# Altium schematic sheet con-right.SchDoc: Connector - Right
size Letter; CheckedBy: E. Chiu; CompanyName: Signal Laboratories, Inc.; DrawnBy: J. Brinton; Engineer: J. Brinton; Address1: 3479 Edison Way; Address2: Menlo Park CA 94025; Address3: +1 (877) 778-8435; Address4: siglabs.com; Revision: 1; SheetNumber: 24; SheetTotal: 40
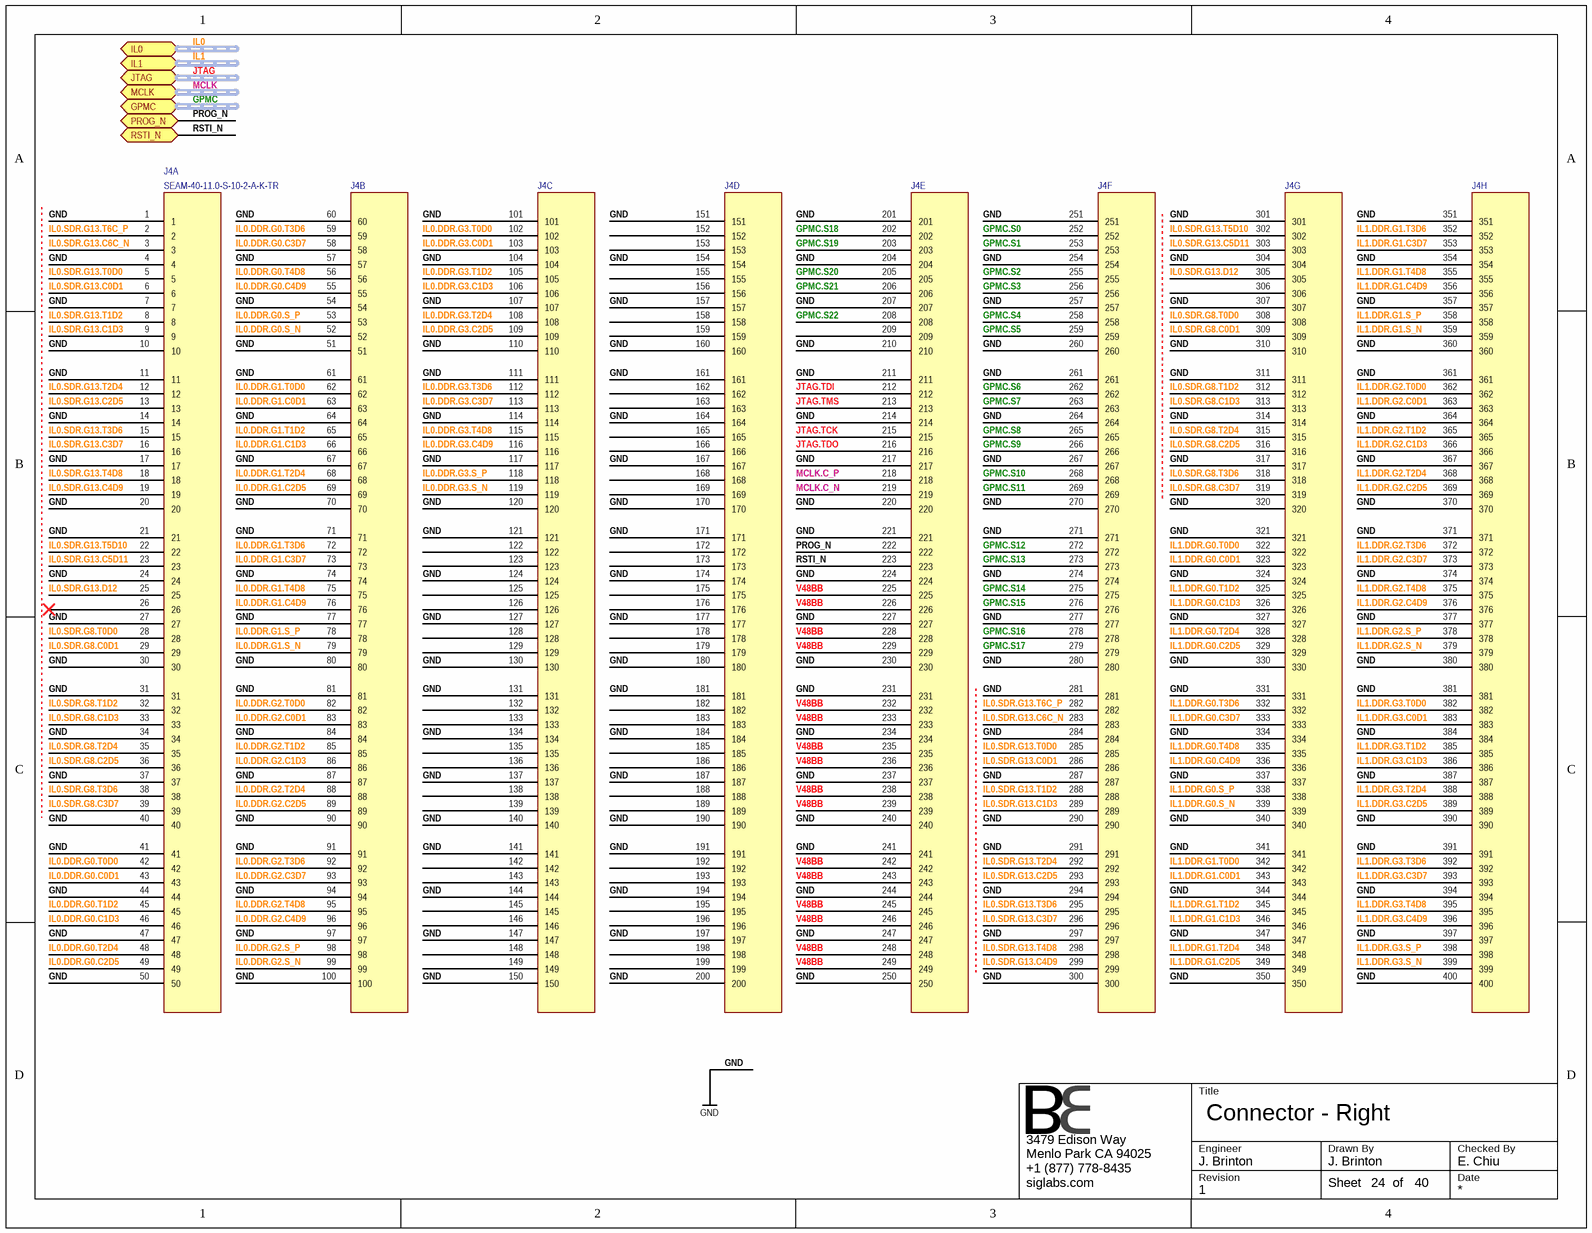
[diagram p0: con-right.SchDoc]

## Parts
J4  SEAM-40-11.0-S-10-2-A-K-TR  [SEAM-40-11.0-S-10-2-A-K-TR]  (parts A,B,C,D,E,F,G,H of 8)

## Ports
GPMC (harness GPMC), IL0 (harness IL-1V35), IL1 (harness IL-1V35), JTAG (harness JTAG-1V5), MCLK (harness LVPECL33), PROG_N (bidir), RSTI_N (bidir)

## Nets
GND: J4.1 J4.4 J4.7 J4.10 J4.11 J4.14 J4.17 J4.20 J4.21 J4.24 J4.27 J4.30 J4.31 J4.34 J4.37 J4.40 J4.41 J4.44 J4.47 J4.50 J4.51 J4.54 J4.57 J4.60 J4.61 J4.64 J4.67 J4.70 J4.71 J4.74 J4.77 J4.80 J4.81 J4.84 J4.87 J4.90 J4.91 J4.94 J4.97 J4.100 J4.101 J4.104 J4.107 J4.110 J4.111 J4.114 J4.117 J4.120 J4.121 J4.124 J4.127 J4.130 J4.131 J4.134 J4.137 J4.140 J4.141 J4.144 J4.147 J4.150 J4.151 J4.154 J4.157 J4.160 J4.161 J4.164 J4.167 J4.170 J4.171 J4.174 J4.177 J4.180 J4.181 J4.184 J4.187 J4.190 J4.191 J4.194 J4.197 J4.200 J4.201 J4.204 J4.207 J4.210 J4.211 J4.214 J4.217 J4.220 J4.221 J4.224 J4.227 J4.230 J4.231 J4.234 J4.237 J4.240 J4.241 J4.244 J4.247 J4.250 J4.251 J4.254 J4.257 J4.260 J4.261 J4.264 J4.267 J4.270 J4.271 J4.274 J4.277 J4.280 J4.281 J4.284 J4.287 J4.290 J4.291 J4.294 J4.297 J4.300 J4.301 J4.304 J4.307 J4.310 J4.311 J4.314 J4.317 J4.320 J4.321 J4.324 J4.327 J4.330 J4.331 J4.334 J4.337 J4.340 J4.341 J4.344 J4.347 J4.350 J4.351 J4.354 J4.357 J4.360 J4.361 J4.364 J4.367 J4.370 J4.371 J4.374 J4.377 J4.380 J4.381 J4.384 J4.387 J4.390 J4.391 J4.394 J4.397 J4.400
GPMC.S0: J4.252
GPMC.S1: J4.253
GPMC.S2: J4.255
GPMC.S3: J4.256
GPMC.S4: J4.258
GPMC.S5: J4.259
GPMC.S6: J4.262
GPMC.S7: J4.263
GPMC.S8: J4.265
GPMC.S9: J4.266
GPMC.S10: J4.268
GPMC.S11: J4.269
GPMC.S12: J4.272
GPMC.S13: J4.273
GPMC.S14: J4.275
GPMC.S15: J4.276
GPMC.S16: J4.278
GPMC.S17: J4.279
GPMC.S18: J4.202
GPMC.S19: J4.203
GPMC.S20: J4.205
GPMC.S21: J4.206
GPMC.S22: J4.208
IL0.DDR.G0.C0D1: J4.43
IL0.DDR.G0.C1D3: J4.46
IL0.DDR.G0.C2D5: J4.49
IL0.DDR.G0.C3D7: J4.58
IL0.DDR.G0.C4D9: J4.55
IL0.DDR.G0.S_N: J4.52
IL0.DDR.G0.S_P: J4.53
IL0.DDR.G0.T0D0: J4.42
IL0.DDR.G0.T1D2: J4.45
IL0.DDR.G0.T2D4: J4.48
IL0.DDR.G0.T3D6: J4.59
IL0.DDR.G0.T4D8: J4.56
IL0.DDR.G1.C0D1: J4.63
IL0.DDR.G1.C1D3: J4.66
IL0.DDR.G1.C2D5: J4.69
IL0.DDR.G1.C3D7: J4.73
IL0.DDR.G1.C4D9: J4.76
IL0.DDR.G1.S_N: J4.79
IL0.DDR.G1.S_P: J4.78
IL0.DDR.G1.T0D0: J4.62
IL0.DDR.G1.T1D2: J4.65
IL0.DDR.G1.T2D4: J4.68
IL0.DDR.G1.T3D6: J4.72
IL0.DDR.G1.T4D8: J4.75
IL0.DDR.G2.C0D1: J4.83
IL0.DDR.G2.C1D3: J4.86
IL0.DDR.G2.C2D5: J4.89
IL0.DDR.G2.C3D7: J4.93
IL0.DDR.G2.C4D9: J4.96
IL0.DDR.G2.S_N: J4.99
IL0.DDR.G2.S_P: J4.98
IL0.DDR.G2.T0D0: J4.82
IL0.DDR.G2.T1D2: J4.85
IL0.DDR.G2.T2D4: J4.88
IL0.DDR.G2.T3D6: J4.92
IL0.DDR.G2.T4D8: J4.95
IL0.DDR.G3.C0D1: J4.103
IL0.DDR.G3.C1D3: J4.106
IL0.DDR.G3.C2D5: J4.109
IL0.DDR.G3.C3D7: J4.113
IL0.DDR.G3.C4D9: J4.116
IL0.DDR.G3.S_N: J4.119
IL0.DDR.G3.S_P: J4.118
IL0.DDR.G3.T0D0: J4.102
IL0.DDR.G3.T1D2: J4.105
IL0.DDR.G3.T2D4: J4.108
IL0.DDR.G3.T3D6: J4.112
IL0.DDR.G3.T4D8: J4.115
IL0.SDR.G8.C0D1: J4.29 J4.309
IL0.SDR.G8.C1D3: J4.33 J4.313
IL0.SDR.G8.C2D5: J4.36 J4.316
IL0.SDR.G8.C3D7: J4.39 J4.319
IL0.SDR.G8.T0D0: J4.28 J4.308
IL0.SDR.G8.T1D2: J4.32 J4.312
IL0.SDR.G8.T2D4: J4.35 J4.315
IL0.SDR.G8.T3D6: J4.38 J4.318
IL0.SDR.G13.C0D1: J4.6 J4.286
IL0.SDR.G13.C1D3: J4.9 J4.289
IL0.SDR.G13.C2D5: J4.13 J4.293
IL0.SDR.G13.C3D7: J4.16 J4.296
IL0.SDR.G13.C4D9: J4.19 J4.299
IL0.SDR.G13.C5D11: J4.23 J4.303
IL0.SDR.G13.C6C_N: J4.3 J4.283
IL0.SDR.G13.D12: J4.25 J4.305
IL0.SDR.G13.T0D0: J4.5 J4.285
IL0.SDR.G13.T1D2: J4.8 J4.288
IL0.SDR.G13.T2D4: J4.12 J4.292
IL0.SDR.G13.T3D6: J4.15 J4.295
IL0.SDR.G13.T4D8: J4.18 J4.298
IL0.SDR.G13.T5D10: J4.22 J4.302
IL0.SDR.G13.T6C_P: J4.2 J4.282
IL1.DDR.G0.C0D1: J4.323
IL1.DDR.G0.C1D3: J4.326
IL1.DDR.G0.C2D5: J4.329
IL1.DDR.G0.C3D7: J4.333
IL1.DDR.G0.C4D9: J4.336
IL1.DDR.G0.S_N: J4.339
IL1.DDR.G0.S_P: J4.338
IL1.DDR.G0.T0D0: J4.322
IL1.DDR.G0.T1D2: J4.325
IL1.DDR.G0.T2D4: J4.328
IL1.DDR.G0.T3D6: J4.332
IL1.DDR.G0.T4D8: J4.335
IL1.DDR.G1.C0D1: J4.343
IL1.DDR.G1.C1D3: J4.346
IL1.DDR.G1.C2D5: J4.349
IL1.DDR.G1.C3D7: J4.353
IL1.DDR.G1.C4D9: J4.356
IL1.DDR.G1.S_N: J4.359
IL1.DDR.G1.S_P: J4.358
IL1.DDR.G1.T0D0: J4.342
IL1.DDR.G1.T1D2: J4.345
IL1.DDR.G1.T2D4: J4.348
IL1.DDR.G1.T3D6: J4.352
IL1.DDR.G1.T4D8: J4.355
IL1.DDR.G2.C0D1: J4.363
IL1.DDR.G2.C1D3: J4.366
IL1.DDR.G2.C2D5: J4.369
IL1.DDR.G2.C3D7: J4.373
IL1.DDR.G2.C4D9: J4.376
IL1.DDR.G2.S_N: J4.379
IL1.DDR.G2.S_P: J4.378
IL1.DDR.G2.T0D0: J4.362
IL1.DDR.G2.T1D2: J4.365
IL1.DDR.G2.T2D4: J4.368
IL1.DDR.G2.T3D6: J4.372
IL1.DDR.G2.T4D8: J4.375
IL1.DDR.G3.C0D1: J4.383
IL1.DDR.G3.C1D3: J4.386
IL1.DDR.G3.C2D5: J4.389
IL1.DDR.G3.C3D7: J4.393
IL1.DDR.G3.C4D9: J4.396
IL1.DDR.G3.S_N: J4.399
IL1.DDR.G3.S_P: J4.398
IL1.DDR.G3.T0D0: J4.382
IL1.DDR.G3.T1D2: J4.385
IL1.DDR.G3.T2D4: J4.388
IL1.DDR.G3.T3D6: J4.392
IL1.DDR.G3.T4D8: J4.395
JTAG.TCK: J4.215
JTAG.TDI: J4.212
JTAG.TDO: J4.216
JTAG.TMS: J4.213
MCLK.C_N: J4.219
MCLK.C_P: J4.218
PROG_N: J4.222 ; port PROG_N
RSTI_N: J4.223 ; port RSTI_N
V48BB: J4.225 J4.226 J4.228 J4.229 J4.232 J4.233 J4.235 J4.236 J4.238 J4.239 J4.242 J4.243 J4.245 J4.246 J4.248 J4.249

Not connected (* = marked no-connect by the designer): J4 26* 122 123 125 126 128 129 132 133 135 136 138 139 142 143 145 146 148 149 152 153 155 156 158 159 162 163 165 166 168 169 172 173 175 176 178 179 182 183 185 186 188 189 192 193 195 196 198 199 209 306

## Buses and harness runs
harness GPMC = port GPMC
harness IL0 = port IL0
harness IL1 = port IL1
harness JTAG = port JTAG
harness MCLK = port MCLK

## Notes on the sheet
- Title
- Engineer
- Revision
- Drawn By
- Checked By
- Date
- Sheet
- of

## Library data of the parts
J4 = SEAM-40-11.0-S-10-2-A-K-TR: Terminal Array Assembly, Surface Mount, 0.050" Pitch, 400 Pins; Manufacturer: Samtec; Manufacturer P/N: SEAM-40-11.0-S-10-2-A-K-TR